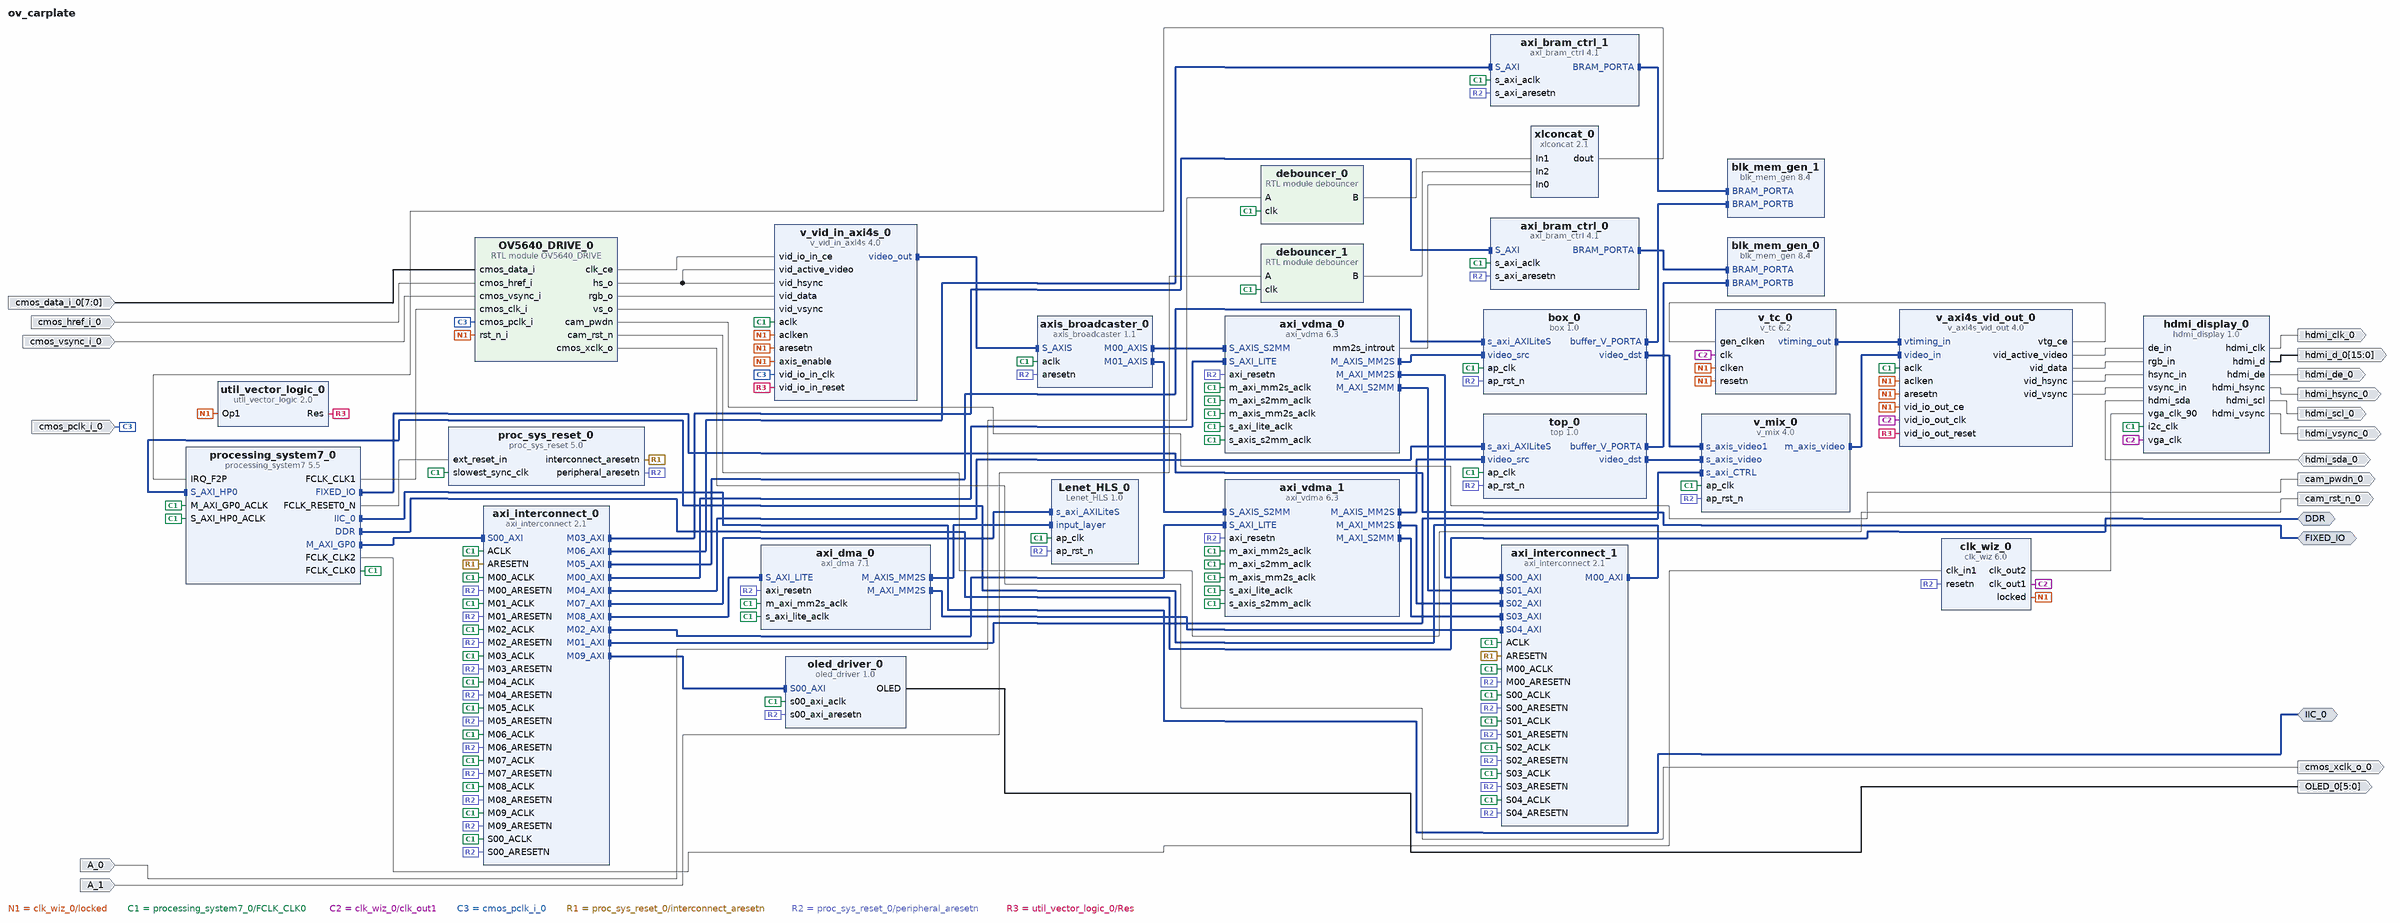
[diagram p0: block diagram of the top level]
# Vivado block design ov_carplate, xc7z020clg484-1, Vivado 2019.2
create_bd_design ov_carplate

create_bd_intf_port -mode Master -vlnv xilinx.com:interface:ddrx_rtl:1.0 DDR
create_bd_intf_port -mode Master -vlnv xilinx.com:display_processing_system7:fixedio_rtl:1.0 FIXED_IO
create_bd_intf_port -mode Master -vlnv xilinx.com:interface:iic_rtl:1.0 IIC_0
create_bd_port -dir I A_0
create_bd_port -dir I A_1
create_bd_port -dir O cam_pwdn_0
create_bd_port -dir O -type rst cam_rst_n_0
create_bd_port -dir I -from 7 -to 0 cmos_data_i_0
create_bd_port -dir I cmos_href_i_0
create_bd_port -dir I cmos_pclk_i_0
create_bd_port -dir I cmos_vsync_i_0
create_bd_port -dir O cmos_xclk_o_0
create_bd_port -dir O -type clk hdmi_clk_0
create_bd_port -dir O -from 15 -to 0 hdmi_d_0
create_bd_port -dir O hdmi_de_0
create_bd_port -dir O hdmi_hsync_0
create_bd_port -dir O hdmi_scl_0
create_bd_port -dir IO hdmi_sda_0
create_bd_port -dir O hdmi_vsync_0
create_bd_port -dir O -from 5 -to 0 OLED_0

create_bd_cell -type ip -vlnv xilinx.com:hls:Lenet_HLS:1.0 Lenet_HLS_0
create_bd_cell -type module -reference OV5640_DRIVE OV5640_DRIVE_0
create_bd_cell -type ip -vlnv xilinx.com:ip:axi_bram_ctrl:4.1 axi_bram_ctrl_0
set_property -dict {CONFIG.SINGLE_PORT_BRAM 1} [get_bd_cells axi_bram_ctrl_0]
create_bd_cell -type ip -vlnv xilinx.com:ip:axi_bram_ctrl:4.1 axi_bram_ctrl_1
set_property -dict {CONFIG.SINGLE_PORT_BRAM 1} [get_bd_cells axi_bram_ctrl_1]
create_bd_cell -type ip -vlnv xilinx.com:ip:axi_dma:7.1 axi_dma_0
set_property -dict {CONFIG.c_include_s2mm 0 CONFIG.c_include_sg 0 CONFIG.c_m_axis_mm2s_tdata_width 16} [get_bd_cells axi_dma_0]
create_bd_cell -type ip -vlnv xilinx.com:ip:axi_interconnect:2.1 axi_interconnect_0
set_property -dict {CONFIG.NUM_MI 10} [get_bd_cells axi_interconnect_0]
create_bd_cell -type ip -vlnv xilinx.com:ip:axi_interconnect:2.1 axi_interconnect_1
set_property -dict {CONFIG.NUM_MI 1 CONFIG.NUM_SI 5} [get_bd_cells axi_interconnect_1]
create_bd_cell -type ip -vlnv xilinx.com:ip:axi_vdma:6.3 axi_vdma_0
set_property -dict [list \
  CONFIG.c_m_axis_mm2s_tdata_width 24 \
  CONFIG.c_mm2s_max_burst_length 16 \
  CONFIG.c_s2mm_max_burst_length 16 \
] [get_bd_cells axi_vdma_0]
create_bd_cell -type ip -vlnv xilinx.com:ip:axi_vdma:6.3 axi_vdma_1
set_property -dict {CONFIG.c_m_axis_mm2s_tdata_width 24} [get_bd_cells axi_vdma_1]
create_bd_cell -type ip -vlnv xilinx.com:ip:axis_broadcaster:1.1 axis_broadcaster_0
set_property -dict [list \
  CONFIG.HAS_TKEEP 1 \
  CONFIG.HAS_TLAST 1 \
  CONFIG.M00_TDATA_REMAP {tdata[23:0]} \
  CONFIG.M00_TUSER_REMAP {tuser[0:0]} \
  CONFIG.M01_TDATA_REMAP {tdata[23:0]} \
  CONFIG.M01_TUSER_REMAP {tuser[0:0]} \
  CONFIG.M_TDATA_NUM_BYTES 3 \
  CONFIG.M_TUSER_WIDTH 1 \
  CONFIG.S_TDATA_NUM_BYTES 3 \
  CONFIG.S_TUSER_WIDTH 1 \
] [get_bd_cells axis_broadcaster_0]
create_bd_cell -type ip -vlnv xilinx.com:ip:blk_mem_gen:8.4 blk_mem_gen_0
set_property -dict [list \
  CONFIG.Enable_B Use_ENB_Pin \
  CONFIG.Memory_Type True_Dual_Port_RAM \
  CONFIG.Port_B_Clock 100 \
  CONFIG.Port_B_Enable_Rate 100 \
  CONFIG.Port_B_Write_Rate 50 \
  CONFIG.Use_RSTB_Pin true \
] [get_bd_cells blk_mem_gen_0]
create_bd_cell -type ip -vlnv xilinx.com:ip:blk_mem_gen:8.4 blk_mem_gen_1
set_property -dict [list \
  CONFIG.Enable_B Use_ENB_Pin \
  CONFIG.Memory_Type True_Dual_Port_RAM \
  CONFIG.Port_B_Clock 100 \
  CONFIG.Port_B_Enable_Rate 100 \
  CONFIG.Port_B_Write_Rate 50 \
  CONFIG.Use_RSTB_Pin true \
] [get_bd_cells blk_mem_gen_1]
create_bd_cell -type ip -vlnv xilinx.com:hls:box:1.0 box_0
create_bd_cell -type ip -vlnv xilinx.com:ip:clk_wiz:6.0 clk_wiz_0
set_property -dict [list \
  CONFIG.CLKOUT1_JITTER 337.616 \
  CONFIG.CLKOUT1_PHASE_ERROR 322.999 \
  CONFIG.CLKOUT1_REQUESTED_OUT_FREQ 74.25 \
  CONFIG.CLKOUT2_JITTER 337.616 \
  CONFIG.CLKOUT2_PHASE_ERROR 322.999 \
  CONFIG.CLKOUT2_REQUESTED_OUT_FREQ 74.25 \
  CONFIG.CLKOUT2_REQUESTED_PHASE 90 \
  CONFIG.CLKOUT2_USED true \
  CONFIG.MMCM_CLKFBOUT_MULT_F 37.125 \
  CONFIG.MMCM_CLKOUT0_DIVIDE_F 10.000 \
  CONFIG.MMCM_CLKOUT1_DIVIDE 10 \
  CONFIG.MMCM_CLKOUT1_PHASE 90.000 \
  CONFIG.MMCM_DIVCLK_DIVIDE 5 \
  CONFIG.NUM_OUT_CLKS 2 \
  CONFIG.PRIM_SOURCE Global_buffer \
  CONFIG.RESET_PORT resetn \
  CONFIG.RESET_TYPE ACTIVE_LOW \
] [get_bd_cells clk_wiz_0]
create_bd_cell -type module -reference debouncer debouncer_0
set_property -dict {CONFIG.COUNT_MAX 65535 CONFIG.COUNT_WIDTH 16} [get_bd_cells debouncer_0]
create_bd_cell -type module -reference debouncer debouncer_1
set_property -dict {CONFIG.COUNT_MAX 65535 CONFIG.COUNT_WIDTH 16} [get_bd_cells debouncer_1]
create_bd_cell -type ip -vlnv xilinx.com:user:hdmi_display:1.0 hdmi_display_0
create_bd_cell -type ip -vlnv xilinx.com:ip:proc_sys_reset:5.0 proc_sys_reset_0
create_bd_cell -type ip -vlnv xilinx.com:ip:processing_system7:5.5 processing_system7_0
set_property -dict [list \
  CONFIG.PCW_APU_PERIPHERAL_FREQMHZ 666.666667 \
  CONFIG.PCW_ENET0_ENET0_IO {MIO 16 .. 27} \
  CONFIG.PCW_ENET0_GRP_MDIO_ENABLE 1 \
  CONFIG.PCW_ENET0_GRP_MDIO_IO {MIO 52 .. 53} \
  CONFIG.PCW_ENET0_PERIPHERAL_ENABLE 1 \
  CONFIG.PCW_ENET0_RESET_ENABLE 0 \
  CONFIG.PCW_ENET_RESET_ENABLE 1 \
  CONFIG.PCW_ENET_RESET_SELECT {Share reset pin} \
  CONFIG.PCW_EN_CLK1_PORT 1 \
  CONFIG.PCW_EN_CLK2_PORT 1 \
  CONFIG.PCW_FCLK_CLK1_BUF TRUE \
  CONFIG.PCW_FPGA0_PERIPHERAL_FREQMHZ 90 \
  CONFIG.PCW_FPGA1_PERIPHERAL_FREQMHZ 25 \
  CONFIG.PCW_FPGA2_PERIPHERAL_FREQMHZ 100 \
  CONFIG.PCW_FPGA_FCLK1_ENABLE 1 \
  CONFIG.PCW_FPGA_FCLK2_ENABLE 1 \
  CONFIG.PCW_GPIO_MIO_GPIO_ENABLE 1 \
  CONFIG.PCW_GPIO_MIO_GPIO_IO MIO \
  CONFIG.PCW_I2C0_I2C0_IO EMIO \
  CONFIG.PCW_I2C0_PERIPHERAL_ENABLE 1 \
  CONFIG.PCW_I2C_PERIPHERAL_FREQMHZ 111.111115 \
  CONFIG.PCW_I2C_RESET_ENABLE 1 \
  CONFIG.PCW_I2C_RESET_SELECT {Share reset pin} \
  CONFIG.PCW_IRQ_F2P_INTR 1 \
  CONFIG.PCW_PRESET_BANK1_VOLTAGE {LVCMOS 1.8V} \
  CONFIG.PCW_QSPI_GRP_SINGLE_SS_ENABLE 1 \
  CONFIG.PCW_QSPI_GRP_SINGLE_SS_IO {MIO 1 .. 6} \
  CONFIG.PCW_QSPI_PERIPHERAL_ENABLE 1 \
  CONFIG.PCW_QSPI_QSPI_IO {MIO 1 .. 6} \
  CONFIG.PCW_SD0_GRP_CD_ENABLE 1 \
  CONFIG.PCW_SD0_GRP_CD_IO {MIO 47} \
  CONFIG.PCW_SD0_GRP_WP_ENABLE 1 \
  CONFIG.PCW_SD0_GRP_WP_IO {MIO 46} \
  CONFIG.PCW_SD0_PERIPHERAL_ENABLE 1 \
  CONFIG.PCW_SD0_SD0_IO {MIO 40 .. 45} \
  CONFIG.PCW_SDIO_PERIPHERAL_FREQMHZ 50 \
  CONFIG.PCW_SINGLE_QSPI_DATA_MODE x4 \
  CONFIG.PCW_TTC0_PERIPHERAL_ENABLE 1 \
  CONFIG.PCW_TTC0_TTC0_IO EMIO \
  CONFIG.PCW_UART1_PERIPHERAL_ENABLE 1 \
  CONFIG.PCW_UART1_UART1_IO {MIO 48 .. 49} \
  CONFIG.PCW_UART_PERIPHERAL_FREQMHZ 50 \
  CONFIG.PCW_UIPARAM_DDR_FREQ_MHZ 533.333313 \
  CONFIG.PCW_UIPARAM_DDR_PARTNO {MT41J128M16 HA-15E} \
  CONFIG.PCW_USB0_PERIPHERAL_ENABLE 1 \
  CONFIG.PCW_USB0_RESET_ENABLE 0 \
  CONFIG.PCW_USB0_USB0_IO {MIO 28 .. 39} \
  CONFIG.PCW_USB_RESET_ENABLE 1 \
  CONFIG.PCW_USB_RESET_SELECT {Share reset pin} \
  CONFIG.PCW_USE_FABRIC_INTERRUPT 1 \
  CONFIG.PCW_USE_S_AXI_HP0 1 \
  CONFIG.preset ZedBoard \
] [get_bd_cells processing_system7_0]
# 225 more settings of processing_system7_0 are not shown: defaults, MIO pin electricals, DDR timing, and values the tool derives
create_bd_cell -type ip -vlnv xilinx.com:hls:top:1.0 top_0
create_bd_cell -type ip -vlnv xilinx.com:ip:util_vector_logic:2.0 util_vector_logic_0
set_property -dict {CONFIG.C_OPERATION not CONFIG.C_SIZE 1} [get_bd_cells util_vector_logic_0]
create_bd_cell -type ip -vlnv xilinx.com:ip:v_axi4s_vid_out:4.0 v_axi4s_vid_out_0
set_property -dict {CONFIG.C_HAS_ASYNC_CLK 1} [get_bd_cells v_axi4s_vid_out_0]
create_bd_cell -type ip -vlnv xilinx.com:ip:v_mix:4.0 v_mix_0
set_property -dict [list \
  CONFIG.LAYER1_INTF_TYPE 1 \
  CONFIG.LAYER1_VIDEO_FORMAT 0 \
  CONFIG.MAX_COLS 1280 \
  CONFIG.MAX_ROWS 720 \
  CONFIG.NR_LAYERS 2 \
] [get_bd_cells v_mix_0]
create_bd_cell -type ip -vlnv xilinx.com:ip:v_tc:6.2 v_tc_0
set_property -dict [list \
  CONFIG.HAS_AXI4_LITE false \
  CONFIG.HAS_INTC_IF false \
  CONFIG.enable_detection false \
  CONFIG.enable_generation true \
] [get_bd_cells v_tc_0]
create_bd_cell -type ip -vlnv xilinx.com:ip:v_vid_in_axi4s:4.0 v_vid_in_axi4s_0
set_property -dict {CONFIG.C_HAS_ASYNC_CLK 1} [get_bd_cells v_vid_in_axi4s_0]
create_bd_cell -type ip -vlnv xilinx.com:ip:xlconcat:2.1 xlconcat_0
set_property -dict {CONFIG.NUM_PORTS 3} [get_bd_cells xlconcat_0]
create_bd_cell -type ip -vlnv xilinx.com:user:oled_driver:1.0 oled_driver_0

# ---- connections ----

connect_bd_intf_net [get_bd_intf_pins axi_vdma_0/S_AXIS_S2MM] [get_bd_intf_pins axis_broadcaster_0/M00_AXIS]
connect_bd_intf_net [get_bd_intf_pins axi_interconnect_1/S02_AXI] [get_bd_intf_pins axi_vdma_1/M_AXI_MM2S]
connect_bd_intf_net [get_bd_intf_pins axi_interconnect_1/S00_AXI] [get_bd_intf_pins axi_vdma_0/M_AXI_MM2S]
connect_bd_intf_net [get_bd_intf_pins box_0/video_dst] [get_bd_intf_pins v_mix_0/s_axis_video1]
connect_bd_intf_net [get_bd_intf_pins axi_vdma_1/M_AXIS_MM2S] [get_bd_intf_pins top_0/video_src]
connect_bd_intf_net [get_bd_intf_ports FIXED_IO] [get_bd_intf_pins processing_system7_0/FIXED_IO]
connect_bd_intf_net [get_bd_intf_ports IIC_0] [get_bd_intf_pins processing_system7_0/IIC_0]
connect_bd_intf_net [get_bd_intf_ports DDR] [get_bd_intf_pins processing_system7_0/DDR]
connect_bd_intf_net [get_bd_intf_pins axi_bram_ctrl_0/S_AXI] [get_bd_intf_pins axi_interconnect_0/M03_AXI]
connect_bd_intf_net [get_bd_intf_pins axi_interconnect_0/M04_AXI] [get_bd_intf_pins top_0/s_axi_AXILiteS]
connect_bd_intf_net [get_bd_intf_pins axi_interconnect_0/M00_AXI] [get_bd_intf_pins axi_vdma_0/S_AXI_LITE]
connect_bd_intf_net [get_bd_intf_pins Lenet_HLS_0/s_axi_AXILiteS] [get_bd_intf_pins axi_interconnect_0/M07_AXI]
connect_bd_intf_net [get_bd_intf_pins axi_interconnect_1/S03_AXI] [get_bd_intf_pins axi_vdma_1/M_AXI_S2MM]
connect_bd_intf_net [get_bd_intf_pins axi_interconnect_0/M02_AXI] [get_bd_intf_pins axi_vdma_1/S_AXI_LITE]
connect_bd_intf_net [get_bd_intf_pins axi_bram_ctrl_0/BRAM_PORTA] [get_bd_intf_pins blk_mem_gen_0/BRAM_PORTA]
connect_bd_intf_net [get_bd_intf_pins axis_broadcaster_0/S_AXIS] [get_bd_intf_pins v_vid_in_axi4s_0/video_out]
connect_bd_intf_net [get_bd_intf_pins blk_mem_gen_1/BRAM_PORTB] [get_bd_intf_pins box_0/buffer_V_PORTA]
connect_bd_intf_net [get_bd_intf_pins axi_vdma_0/M_AXIS_MM2S] [get_bd_intf_pins box_0/video_src]
connect_bd_intf_net [get_bd_intf_pins axi_interconnect_1/S01_AXI] [get_bd_intf_pins axi_vdma_0/M_AXI_S2MM]
connect_bd_intf_net [get_bd_intf_pins axi_dma_0/M_AXI_MM2S] [get_bd_intf_pins axi_interconnect_1/S04_AXI]
connect_bd_intf_net [get_bd_intf_pins axi_bram_ctrl_1/BRAM_PORTA] [get_bd_intf_pins blk_mem_gen_1/BRAM_PORTA]
connect_bd_intf_net [get_bd_intf_pins axi_dma_0/S_AXI_LITE] [get_bd_intf_pins axi_interconnect_0/M08_AXI]
connect_bd_intf_net [get_bd_intf_pins v_axi4s_vid_out_0/video_in] [get_bd_intf_pins v_mix_0/m_axis_video]
connect_bd_intf_net [get_bd_intf_pins axi_interconnect_0/S00_AXI] [get_bd_intf_pins processing_system7_0/M_AXI_GP0]
connect_bd_intf_net [get_bd_intf_pins axi_interconnect_1/M00_AXI] [get_bd_intf_pins processing_system7_0/S_AXI_HP0]
connect_bd_intf_net [get_bd_intf_pins axi_bram_ctrl_1/S_AXI] [get_bd_intf_pins axi_interconnect_0/M06_AXI]
connect_bd_intf_net [get_bd_intf_pins axi_vdma_1/S_AXIS_S2MM] [get_bd_intf_pins axis_broadcaster_0/M01_AXIS]
connect_bd_intf_net [get_bd_intf_pins v_axi4s_vid_out_0/vtiming_in] [get_bd_intf_pins v_tc_0/vtiming_out]
connect_bd_intf_net [get_bd_intf_pins top_0/video_dst] [get_bd_intf_pins v_mix_0/s_axis_video]
connect_bd_intf_net [get_bd_intf_pins blk_mem_gen_0/BRAM_PORTB] [get_bd_intf_pins top_0/buffer_V_PORTA]
connect_bd_intf_net [get_bd_intf_pins Lenet_HLS_0/input_layer] [get_bd_intf_pins axi_dma_0/M_AXIS_MM2S]
connect_bd_intf_net [get_bd_intf_pins axi_interconnect_0/M01_AXI] [get_bd_intf_pins v_mix_0/s_axi_CTRL]
connect_bd_intf_net [get_bd_intf_pins axi_interconnect_0/M05_AXI] [get_bd_intf_pins box_0/s_axi_AXILiteS]
connect_bd_intf_net [get_bd_intf_pins axi_interconnect_0/M09_AXI] [get_bd_intf_pins oled_driver_0/S00_AXI]
connect_bd_net -net A_0_1 [get_bd_ports A_0] [get_bd_pins debouncer_0/A]
connect_bd_net -net A_1_1 [get_bd_ports A_1] [get_bd_pins debouncer_1/A]
connect_bd_net [get_bd_pins clk_wiz_0/locked] \
  [get_bd_pins OV5640_DRIVE_0/rst_n_i] [get_bd_pins util_vector_logic_0/Op1] [get_bd_pins v_axi4s_vid_out_0/aclken] \
  [get_bd_pins v_axi4s_vid_out_0/aresetn] [get_bd_pins v_axi4s_vid_out_0/vid_io_out_ce] [get_bd_pins v_tc_0/clken] \
  [get_bd_pins v_tc_0/resetn] [get_bd_pins v_vid_in_axi4s_0/aclken] [get_bd_pins v_vid_in_axi4s_0/aresetn] \
  [get_bd_pins v_vid_in_axi4s_0/axis_enable]
connect_bd_net [get_bd_pins processing_system7_0/FCLK_CLK0] \
  [get_bd_pins Lenet_HLS_0/ap_clk] [get_bd_pins axi_bram_ctrl_0/s_axi_aclk] [get_bd_pins axi_bram_ctrl_1/s_axi_aclk] \
  [get_bd_pins axi_dma_0/m_axi_mm2s_aclk] [get_bd_pins axi_dma_0/s_axi_lite_aclk] [get_bd_pins axi_interconnect_0/ACLK] \
  [get_bd_pins axi_interconnect_0/M00_ACLK] [get_bd_pins axi_interconnect_0/M01_ACLK] \
  [get_bd_pins axi_interconnect_0/M02_ACLK] [get_bd_pins axi_interconnect_0/M03_ACLK] \
  [get_bd_pins axi_interconnect_0/M04_ACLK] [get_bd_pins axi_interconnect_0/M05_ACLK] \
  [get_bd_pins axi_interconnect_0/M06_ACLK] [get_bd_pins axi_interconnect_0/M07_ACLK] \
  [get_bd_pins axi_interconnect_0/M08_ACLK] [get_bd_pins axi_interconnect_0/S00_ACLK] [get_bd_pins axi_interconnect_1/ACLK] \
  [get_bd_pins axi_interconnect_1/M00_ACLK] [get_bd_pins axi_interconnect_1/S00_ACLK] \
  [get_bd_pins axi_interconnect_1/S01_ACLK] [get_bd_pins axi_interconnect_1/S02_ACLK] \
  [get_bd_pins axi_interconnect_1/S03_ACLK] [get_bd_pins axi_interconnect_1/S04_ACLK] \
  [get_bd_pins axi_vdma_0/m_axi_mm2s_aclk] [get_bd_pins axi_vdma_0/m_axi_s2mm_aclk] [get_bd_pins axi_vdma_0/m_axis_mm2s_aclk] \
  [get_bd_pins axi_vdma_0/s_axi_lite_aclk] [get_bd_pins axi_vdma_0/s_axis_s2mm_aclk] [get_bd_pins axi_vdma_1/m_axi_mm2s_aclk] \
  [get_bd_pins axi_vdma_1/m_axi_s2mm_aclk] [get_bd_pins axi_vdma_1/m_axis_mm2s_aclk] [get_bd_pins axi_vdma_1/s_axi_lite_aclk] \
  [get_bd_pins axi_vdma_1/s_axis_s2mm_aclk] [get_bd_pins axis_broadcaster_0/aclk] [get_bd_pins box_0/ap_clk] \
  [get_bd_pins debouncer_0/clk] [get_bd_pins debouncer_1/clk] [get_bd_pins hdmi_display_0/i2c_clk] \
  [get_bd_pins proc_sys_reset_0/slowest_sync_clk] [get_bd_pins processing_system7_0/M_AXI_GP0_ACLK] \
  [get_bd_pins processing_system7_0/S_AXI_HP0_ACLK] [get_bd_pins top_0/ap_clk] [get_bd_pins v_axi4s_vid_out_0/aclk] \
  [get_bd_pins v_mix_0/ap_clk] [get_bd_pins v_vid_in_axi4s_0/aclk] [get_bd_pins oled_driver_0/s00_axi_aclk] \
  [get_bd_pins axi_interconnect_0/M09_ACLK]
connect_bd_net [get_bd_ports hdmi_sda_0] [get_bd_pins hdmi_display_0/hdmi_sda]
connect_bd_net [get_bd_pins OV5640_DRIVE_0/cam_pwdn] [get_bd_ports cam_pwdn_0]
connect_bd_net [get_bd_pins OV5640_DRIVE_0/cam_rst_n] [get_bd_ports cam_rst_n_0]
connect_bd_net [get_bd_pins OV5640_DRIVE_0/clk_ce] [get_bd_pins v_vid_in_axi4s_0/vid_io_in_ce]
connect_bd_net [get_bd_pins OV5640_DRIVE_0/cmos_xclk_o] [get_bd_ports cmos_xclk_o_0]
connect_bd_net [get_bd_pins OV5640_DRIVE_0/hs_o] [get_bd_pins v_vid_in_axi4s_0/vid_active_video] [get_bd_pins v_vid_in_axi4s_0/vid_hsync]
connect_bd_net [get_bd_pins OV5640_DRIVE_0/rgb_o] [get_bd_pins v_vid_in_axi4s_0/vid_data]
connect_bd_net [get_bd_pins OV5640_DRIVE_0/vs_o] [get_bd_pins v_vid_in_axi4s_0/vid_vsync]
connect_bd_net [get_bd_pins axi_vdma_0/mm2s_introut] [get_bd_pins xlconcat_0/In0]
connect_bd_net [get_bd_pins clk_wiz_0/clk_out1] \
  [get_bd_pins hdmi_display_0/vga_clk] [get_bd_pins v_axi4s_vid_out_0/vid_io_out_clk] [get_bd_pins v_tc_0/clk]
connect_bd_net [get_bd_pins clk_wiz_0/clk_out2] [get_bd_pins hdmi_display_0/vga_clk_90]
connect_bd_net -net cmos_data_i_0_1 [get_bd_ports cmos_data_i_0] [get_bd_pins OV5640_DRIVE_0/cmos_data_i]
connect_bd_net -net cmos_href_i_0_1 [get_bd_ports cmos_href_i_0] [get_bd_pins OV5640_DRIVE_0/cmos_href_i]
connect_bd_net -net cmos_pclk_i_0_1 [get_bd_ports cmos_pclk_i_0] [get_bd_pins OV5640_DRIVE_0/cmos_pclk_i] [get_bd_pins v_vid_in_axi4s_0/vid_io_in_clk]
connect_bd_net -net cmos_vsync_i_0_1 [get_bd_ports cmos_vsync_i_0] [get_bd_pins OV5640_DRIVE_0/cmos_vsync_i]
connect_bd_net [get_bd_pins debouncer_0/B] [get_bd_pins xlconcat_0/In1]
connect_bd_net [get_bd_pins debouncer_1/B] [get_bd_pins xlconcat_0/In2]
connect_bd_net [get_bd_pins hdmi_display_0/hdmi_clk] [get_bd_ports hdmi_clk_0]
connect_bd_net [get_bd_pins hdmi_display_0/hdmi_d] [get_bd_ports hdmi_d_0]
connect_bd_net [get_bd_pins hdmi_display_0/hdmi_de] [get_bd_ports hdmi_de_0]
connect_bd_net [get_bd_pins hdmi_display_0/hdmi_hsync] [get_bd_ports hdmi_hsync_0]
connect_bd_net [get_bd_pins hdmi_display_0/hdmi_scl] [get_bd_ports hdmi_scl_0]
connect_bd_net [get_bd_pins hdmi_display_0/hdmi_vsync] [get_bd_ports hdmi_vsync_0]
connect_bd_net [get_bd_pins proc_sys_reset_0/interconnect_aresetn] [get_bd_pins axi_interconnect_0/ARESETN] [get_bd_pins axi_interconnect_1/ARESETN]
connect_bd_net [get_bd_pins proc_sys_reset_0/peripheral_aresetn] \
  [get_bd_pins Lenet_HLS_0/ap_rst_n] [get_bd_pins axi_bram_ctrl_0/s_axi_aresetn] [get_bd_pins axi_bram_ctrl_1/s_axi_aresetn] \
  [get_bd_pins axi_dma_0/axi_resetn] [get_bd_pins axi_interconnect_0/M00_ARESETN] \
  [get_bd_pins axi_interconnect_0/M01_ARESETN] [get_bd_pins axi_interconnect_0/M02_ARESETN] \
  [get_bd_pins axi_interconnect_0/M03_ARESETN] [get_bd_pins axi_interconnect_0/M04_ARESETN] \
  [get_bd_pins axi_interconnect_0/M05_ARESETN] [get_bd_pins axi_interconnect_0/M06_ARESETN] \
  [get_bd_pins axi_interconnect_0/M07_ARESETN] [get_bd_pins axi_interconnect_0/M08_ARESETN] \
  [get_bd_pins axi_interconnect_0/S00_ARESETN] [get_bd_pins axi_interconnect_1/M00_ARESETN] \
  [get_bd_pins axi_interconnect_1/S00_ARESETN] [get_bd_pins axi_interconnect_1/S01_ARESETN] \
  [get_bd_pins axi_interconnect_1/S02_ARESETN] [get_bd_pins axi_interconnect_1/S03_ARESETN] \
  [get_bd_pins axi_interconnect_1/S04_ARESETN] [get_bd_pins axi_vdma_0/axi_resetn] [get_bd_pins axi_vdma_1/axi_resetn] \
  [get_bd_pins axis_broadcaster_0/aresetn] [get_bd_pins box_0/ap_rst_n] [get_bd_pins clk_wiz_0/resetn] \
  [get_bd_pins top_0/ap_rst_n] [get_bd_pins v_mix_0/ap_rst_n] [get_bd_pins oled_driver_0/s00_axi_aresetn] \
  [get_bd_pins axi_interconnect_0/M09_ARESETN]
connect_bd_net [get_bd_pins processing_system7_0/FCLK_CLK1] [get_bd_pins OV5640_DRIVE_0/cmos_clk_i]
connect_bd_net [get_bd_pins processing_system7_0/FCLK_CLK2] [get_bd_pins clk_wiz_0/clk_in1]
connect_bd_net [get_bd_pins processing_system7_0/FCLK_RESET0_N] [get_bd_pins proc_sys_reset_0/ext_reset_in]
connect_bd_net [get_bd_pins util_vector_logic_0/Res] [get_bd_pins v_axi4s_vid_out_0/vid_io_out_reset] [get_bd_pins v_vid_in_axi4s_0/vid_io_in_reset]
connect_bd_net [get_bd_pins v_axi4s_vid_out_0/vid_active_video] [get_bd_pins hdmi_display_0/de_in]
connect_bd_net [get_bd_pins v_axi4s_vid_out_0/vid_data] [get_bd_pins hdmi_display_0/rgb_in]
connect_bd_net [get_bd_pins v_axi4s_vid_out_0/vid_hsync] [get_bd_pins hdmi_display_0/hsync_in]
connect_bd_net [get_bd_pins v_axi4s_vid_out_0/vid_vsync] [get_bd_pins hdmi_display_0/vsync_in]
connect_bd_net [get_bd_pins v_axi4s_vid_out_0/vtg_ce] [get_bd_pins v_tc_0/gen_clken]
connect_bd_net [get_bd_pins xlconcat_0/dout] [get_bd_pins processing_system7_0/IRQ_F2P]
connect_bd_net [get_bd_pins oled_driver_0/OLED] [get_bd_ports OLED_0]
set_property HDL_ATTRIBUTE.BMM_INFO_ADDRESS_SPACE {byte  0x40000000 32 > ov_carplate blk_mem_gen_0} [get_bd_cells axi_bram_ctrl_0]
set_property HDL_ATTRIBUTE.KEEP_HIERARCHY yes [get_bd_cells axi_bram_ctrl_0]
set_property HDL_ATTRIBUTE.BMM_INFO_ADDRESS_SPACE {byte  0x42000000 32 > ov_carplate blk_mem_gen_1} [get_bd_cells axi_bram_ctrl_1]
set_property HDL_ATTRIBUTE.KEEP_HIERARCHY yes [get_bd_cells axi_bram_ctrl_1]
set_property HDL_ATTRIBUTE.BMM_INFO_PROCESSOR {arm > ov_carplate axi_bram_ctrl_0 ov_carplate axi_bram_ctrl_1} [get_bd_cells processing_system7_0]
set_property HDL_ATTRIBUTE.KEEP_HIERARCHY yes [get_bd_cells processing_system7_0]

# ---- address map ----
assign_bd_address -offset 0x08000000 -range 32M -target_address_space [get_bd_addr_spaces axi_dma_0/Data_MM2S] [get_bd_addr_segs processing_system7_0/S_AXI_HP0/HP0_DDR_LOWOCM]
assign_bd_address -offset 0x00000000 -range 64M -target_address_space [get_bd_addr_spaces axi_vdma_0/Data_MM2S] [get_bd_addr_segs processing_system7_0/S_AXI_HP0/HP0_DDR_LOWOCM]
assign_bd_address -offset 0x00000000 -range 64M -target_address_space [get_bd_addr_spaces axi_vdma_0/Data_S2MM] [get_bd_addr_segs processing_system7_0/S_AXI_HP0/HP0_DDR_LOWOCM]
assign_bd_address -offset 0x04000000 -range 64M -target_address_space [get_bd_addr_spaces axi_vdma_1/Data_MM2S] [get_bd_addr_segs processing_system7_0/S_AXI_HP0/HP0_DDR_LOWOCM]
assign_bd_address -offset 0x04000000 -range 64M -target_address_space [get_bd_addr_spaces axi_vdma_1/Data_S2MM] [get_bd_addr_segs processing_system7_0/S_AXI_HP0/HP0_DDR_LOWOCM]
assign_bd_address -offset 0x40000000 -range 8K -target_address_space [get_bd_addr_spaces processing_system7_0/Data] [get_bd_addr_segs axi_bram_ctrl_0/S_AXI/Mem0]
assign_bd_address -offset 0x40400000 -range 64K -target_address_space [get_bd_addr_spaces processing_system7_0/Data] [get_bd_addr_segs axi_dma_0/S_AXI_LITE/Reg]
assign_bd_address -offset 0x42000000 -range 16K -target_address_space [get_bd_addr_spaces processing_system7_0/Data] [get_bd_addr_segs axi_bram_ctrl_1/S_AXI/Mem0]
assign_bd_address -offset 0x43000000 -range 64K -target_address_space [get_bd_addr_spaces processing_system7_0/Data] [get_bd_addr_segs axi_vdma_0/S_AXI_LITE/Reg]
assign_bd_address -offset 0x43010000 -range 64K -target_address_space [get_bd_addr_spaces processing_system7_0/Data] [get_bd_addr_segs axi_vdma_1/S_AXI_LITE/Reg]
assign_bd_address -offset 0x43C00000 -range 64K -target_address_space [get_bd_addr_spaces processing_system7_0/Data] [get_bd_addr_segs v_mix_0/s_axi_CTRL/Reg]
assign_bd_address -offset 0x43C10000 -range 64K -target_address_space [get_bd_addr_spaces processing_system7_0/Data] [get_bd_addr_segs top_0/s_axi_AXILiteS/Reg]
assign_bd_address -offset 0x43C20000 -range 64K -target_address_space [get_bd_addr_spaces processing_system7_0/Data] [get_bd_addr_segs box_0/s_axi_AXILiteS/Reg]
assign_bd_address -offset 0x43C30000 -range 64K -target_address_space [get_bd_addr_spaces processing_system7_0/Data] [get_bd_addr_segs Lenet_HLS_0/s_axi_AXILiteS/Reg]
assign_bd_address -offset 0x43C40000 -range 64K -target_address_space [get_bd_addr_spaces processing_system7_0/Data] [get_bd_addr_segs oled_driver_0/S00_AXI/S00_AXI_reg]

validate_bd_design
save_bd_design
